# Altium schematic sheet 2CAN_Peripherals.SchDoc
size Tabloid; SheetNumber: 3; SheetTotal: 3
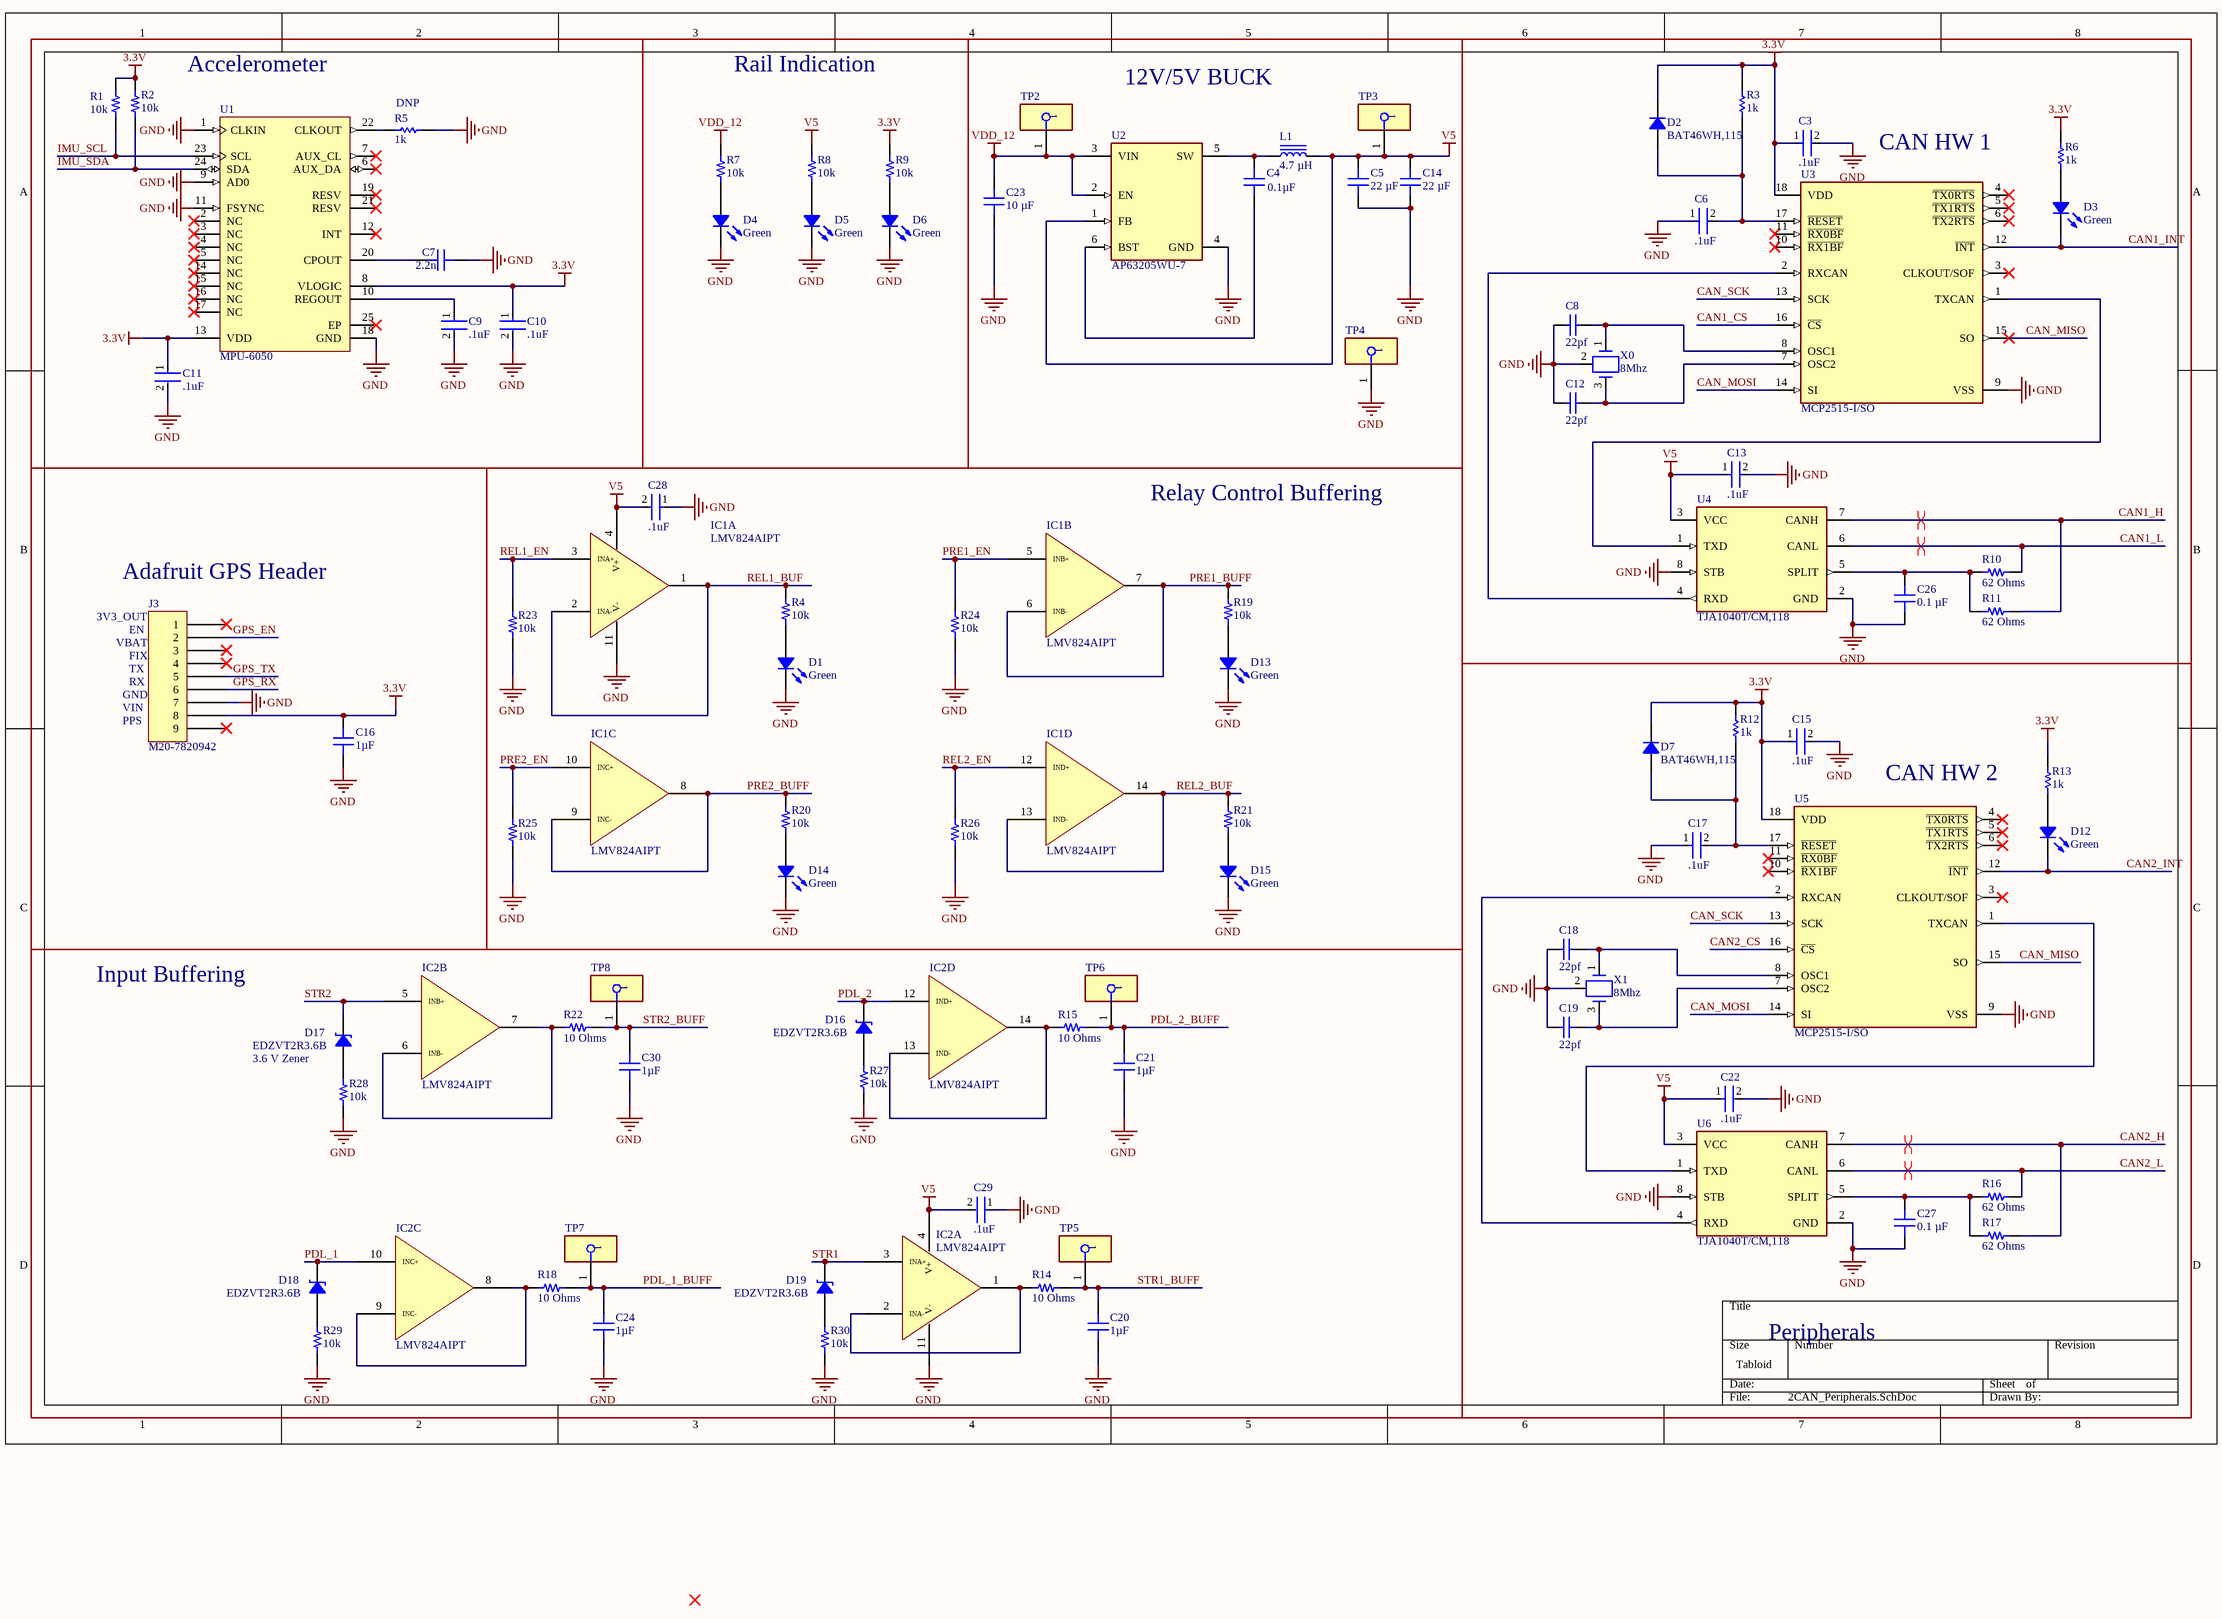
[diagram p0: 2CAN_Peripherals.SchDoc]

## Parts
C3  .1uF  [FP-CGA3E-0_3-0_1-IPC_A]
C4  0.1µF  [CAP 0603_1608]
C5  22 µF  [CAP 0805_2012]
C6  .1uF  [FP-CGA3E-0_3-0_1-IPC_A]
C7  2.2n  [CAP 0603_1608]
C8  22pf  [CAPC1608X90X35ML10T15]
C9  .1uF  [FP-CGA3E-0_3-0_1-IPC_A]
C10  .1uF  [FP-CGA3E-0_3-0_1-IPC_A]
C11  .1uF  [FP-CGA3E-0_3-0_1-IPC_A]
C12  22pf  [CAPC1608X90X35ML10T15]
C13  .1uF  [FP-CGA3E-0_3-0_1-IPC_A]
C14  22 µF  [CAP 0805_2012]
C15  .1uF  [FP-CGA3E-0_3-0_1-IPC_A]
C16  1µF  [CAP 0603_1608]
C17  .1uF  [FP-CGA3E-0_3-0_1-IPC_A]
C18  22pf  [CAPC1608X90X35ML10T15]
C19  22pf  [CAPC1608X90X35ML10T15]
C20  1µF  [CAP 0603_1608]
C21  1µF  [CAP 0603_1608]
C22  .1uF  [FP-CGA3E-0_3-0_1-IPC_A]
C23  10 µF  [CAP 0805_2012]
C24  1µF  [CAP 0603_1608]
C26  0.1 µF  [CAP 0603_1608]
C27  0.1 µF  [CAP 0603_1608]
C28  .1uF  [FP-CGA3E-0_3-0_1-IPC_A]
C29  .1uF  [FP-CGA3E-0_3-0_1-IPC_A]
C30  1µF  [CAP 0603_1608]
D1  Green  [LED 0603_1608 GREEN]
D2  BAT46WH,115  [SOD123F]
D3  Green  [LED 0603_1608 GREEN]
D4  Green  [LED 0603_1608 GREEN]
D5  Green  [LED 0603_1608 GREEN]
D6  Green  [LED 0603_1608 GREEN]
D7  BAT46WH,115  [SOD123F]
D12  Green  [LED 0603_1608 GREEN]
D13  Green  [LED 0603_1608 GREEN]
D14  Green  [LED 0603_1608 GREEN]
D15  Green  [LED 0603_1608 GREEN]
D16  EDZVT2R3.6B  [SOD523F]
D17  EDZVT2R3.6B  [SOD523F]
D18  EDZVT2R3.6B  [SOD523F]
D19  EDZVT2R3.6B  [SOD523F]
IC1  LMV824AIPT  [TI TSSOP-14 PW]  (parts A,B,C,D of 4)
IC2  LMV824AIPT  [TI TSSOP-14 PW]  (parts A,B,C,D of 4)
J3  M20-7820942  [HARWIN M20-7820945]
L1  4.7 µH  [WURTH WE-LQS 6045]
R1  10k  [RES 0603_1608]
R2  10k  [RES 0603_1608]
R3  1k  [RESC1608X55X30LL15T15]
R4  10k  [RES 0603_1608]
R5  1k  [RESC1608X55X30LL15T15]
R6  1k  [RESC1608X55X30LL15T15]
R7  10k  [RES 0603_1608]
R8  10k  [RES 0603_1608]
R9  10k  [RES 0603_1608]
R10  62 Ohms  [RES 0603_1608]
R11  62 Ohms  [RES 0603_1608]
R12  1k  [RESC1608X55X30LL15T15]
R13  1k  [RESC1608X55X30LL15T15]
R14  10 Ohms  [RES 0603_1608]
R15  10 Ohms  [RES 0603_1608]
R16  62 Ohms  [RES 0603_1608]
R17  62 Ohms  [RES 0603_1608]
R18  10 Ohms  [RES 0603_1608]
R19  10k  [RES 0603_1608]
R20  10k  [RES 0603_1608]
R21  10k  [RES 0603_1608]
R22  10 Ohms  [RES 0603_1608]
R23  10k  [RES 0603_1608]
R24  10k  [RES 0603_1608]
R25  10k  [RES 0603_1608]
R26  10k  [RES 0603_1608]
R27  10k  [RES 0603_1608]
R28  10k  [RES 0603_1608]
R29  10k  [RES 0603_1608]
R30  10k  [RES 0603_1608]
TP2  S2761-46R  [FP-S2761-46R-MFG]  (value not drawn)
TP3  S2761-46R  [FP-S2761-46R-MFG]  (value not drawn)
TP4  S2761-46R  [FP-S2761-46R-MFG]  (value not drawn)
TP5  S2761-46R  [FP-S2761-46R-MFG]  (value not drawn)
TP6  S2761-46R  [FP-S2761-46R-MFG]  (value not drawn)
TP7  S2761-46R  [FP-S2761-46R-MFG]  (value not drawn)
TP8  S2761-46R  [FP-S2761-46R-MFG]  (value not drawn)
U1  MPU-6050  [IS-QFN-24_V]
U2  AP63205WU-7  [FP-TSOT26-MFG]
U3  MCP2515-I/SO  [FP-C04-051-IPC_C]
U4  TJA1040T/CM,118  [FP-SOT96-1-MFG]
U5  MCP2515-I/SO  [FP-C04-051-IPC_C]
U6  TJA1040T/CM,118  [FP-SOT96-1-MFG]
X0  8Mhz  [ECS-4X-3IL]
X1  8Mhz  [ECS-4X-3IL]

## Blocks framed on the sheet
Accelerometer: C7 C9-C11 R1 R2 R5 U1
Rail Indication: D4-D6 R7-R9
12V/5V BUCK: C4 C5 C14 C23 L1 TP2-TP4 U2
CAN HW 1: C3 C6 C8 C12 C13 C26 D2 D3 R3 R6 R10 R11 U3 U4 X0
Adafruit GPS Header: C16 J3
Relay Control Buffering: C28 D1 D13-D15 IC1 R4 R19-R21 R23-R26
Input Buffering: C20 C21 C24 C29 C30 D16-D19 IC2 R14 R15 R18 R22 R27-R30 TP5-TP8

## Nets
3.3V: C3.1 C10.1 C11.1 C15.1 C16.2 D2.2 D7.2 J3.8 R1.2 R2.2 R3.1 R6.1 R9.2 R12.1 R13.1 U1.8(VLOGIC) U1.13(VDD) U3.18(VDD) U5.18(VDD)
GND: C3.2 C5.1 C6.1 C7.2 C8.1 C9.2 C10.2 C11.2 C12.1 C13.2 C14.1 C15.2 C16.1 C17.1 C18.1 C19.1 C20.1 C21.1 C22.2 C23.1 C24.1 C26.1 C27.1 C28.1 C29.1 C30.1 D1.2 D4.2 D5.2 D6.2 D13.2 D14.2 D15.2 IC1.11(V-) IC2.11(V-) J3.7 R5.2 R23.1 R24.1 R25.1 R26.1 R27.1 R28.1 R29.1 R30.1 TP4.1 U1.1(CLKIN) U1.9(AD0) U1.11(FSYNC) U1.18(GND) U2.4(GND) U3.9(VSS) U4.2(GND) U4.8(STB) U5.9(VSS) U6.2(GND) U6.8(STB) X0.2 X1.2
V5: C5.2 C13.1 C14.2 C22.1 C28.2 C29.2 IC1.4(V+) IC2.4(V+) L1.2 R8.2 TP3.1 U2.1(FB) U4.3(VCC) U6.3(VCC)
VDD_12: C23.2 R7.2 TP2.1 U2.2(EN) U2.3(VIN)
CAN1_CS: U3.16(~{CS})
CAN1_H: R11.2 U4.7(CANH)
CAN1_INT: D3.2 U3.12(~{INT})
CAN1_L: R10.2 U4.6(CANL)
CAN2_CS: U5.16(~{CS})
CAN2_H: R17.2 U6.7(CANH)
CAN2_INT: D12.2 U5.12(~{INT})
CAN2_L: R16.2 U6.6(CANL)
CAN_MISO: U3.15(SO) U5.15(SO)
CAN_MOSI: U3.14(SI) U5.14(SI)
CAN_SCK: U3.13(SCK) U5.13(SCK)
GPS_EN: J3.2
GPS_RX: J3.6
GPS_TX: J3.5
IMU_SCL: R1.1 U1.23(SCL)
IMU_SDA: R2.1 U1.24(SDA)
PDL_1: D18.2 IC2.10(INC+)
PDL_1_BUFF: C24.2 R18.2 TP7.1
PDL_2: D16.2 IC2.12(IND+)
PDL_2_BUFF: C21.2 R15.2 TP6.1
PRE1_BUFF: IC1.6(INB-) IC1.7(OUTB) R19.2
PRE1_EN: IC1.5(INB+) R24.2
PRE2_BUFF: IC1.8(OUTC) IC1.9(INC-) R20.2
PRE2_EN: IC1.10(INC+) R25.2
REL1_BUF: IC1.1(OUT) IC1.2(INA-) R4.2
REL1_EN: IC1.3(INA+) R23.2
REL2_BUF: IC1.13(IND-) IC1.14(OUTD) R21.2
REL2_EN: IC1.12(IND+) R26.2
STR1: D19.2 IC2.3(INA+)
STR1_BUFF: C20.2 R14.2 TP5.1
STR2: D17.2 IC2.5(INB+)
STR2_BUFF: C30.2 R22.2 TP8.1
NetC4_1: C4.1 U2.6(BST)
NetC4_2: C4.2 L1.1 U2.5(SW)
NetC6_2: C6.2 D2.1 R3.2 U3.17(~{RESET})
NetC7_1: C7.1 U1.20(CPOUT)
NetC8_2: C8.2 U3.8(OSC1) X0.1
NetC9_1: C9.1 U1.10(REGOUT)
NetC12_2: C12.2 U3.7(OSC2) X0.3
NetC17_2: C17.2 D7.1 R12.2 U5.17(~{RESET})
NetC18_2: C18.2 U5.8(OSC1) X1.1
NetC19_2: C19.2 U5.7(OSC2) X1.3
NetC26_2: C26.2 R10.1 R11.1 U4.5(SPLIT)
NetC27_2: C27.2 R16.1 R17.1 U6.5(SPLIT)
NetD1_1: D1.1 R4.1
NetD3_1: D3.1 R6.2
NetD4_1: D4.1 R7.1
NetD5_1: D5.1 R8.1
NetD6_1: D6.1 R9.1
NetD12_1: D12.1 R13.2
NetD13_1: D13.1 R19.1
NetD14_1: D14.1 R20.1
NetD15_1: D15.1 R21.1
NetD16_1: D16.1 R27.2
NetD17_1: D17.1 R28.2
NetD18_1: D18.1 R29.2
NetD19_1: D19.1 R30.2
NetIC2_1: IC2.1(OUT) IC2.2(INA-) R14.1
NetIC2_6: IC2.6(INB-) IC2.7(OUTB) R22.1
NetIC2_8: IC2.8(OUTC) IC2.9(INC-) R18.1
NetIC2_13: IC2.13(IND-) IC2.14(OUTD) R15.1
NetR5_1: R5.1 U1.22(CLKOUT)
NetU3_1: U3.1(TXCAN) U4.1(TXD)
NetU3_2: U3.2(RXCAN) U4.4(RXD)
NetU5_1: U5.1(TXCAN) U6.1(TXD)
NetU5_2: U5.2(RXCAN) U6.4(RXD)

Not connected (* = marked no-connect by the designer): J3 1* 3* 4* 9*; U1 2(NC)* 3(NC)* 4(NC)* 5(NC)* 6(AUX_DA)* 7(AUX_CL)* 12(INT)* 14(NC)* 15(NC)* 16(NC)* 17(NC)* 19(RESV)* 21(RESV)* 25(EP)*; U3 3(CLKOUT/SOF)* 4(~{TX0RTS})* 5(~{TX1RTS})* 6(~{TX2RTS})* 10(~{RX1BF})* 11(~{RX0BF})*; U5 3(CLKOUT/SOF)* 4(~{TX0RTS})* 5(~{TX1RTS})* 6(~{TX2RTS})* 10(~{RX1BF})* 11(~{RX0BF})*

## Layout directives
differential pair: CAN1_H, CAN1_L, CAN2_H, CAN2_L

## Notes on the sheet
- (near R5) DNP
- (near J3) 3V3_OUT
- (near J3) VBAT
- (near J3) EN
- (near J3) FIX
- (near J3) TX
- (near J3) RX
- (near J3) GND
- (near J3) VIN
- (near J3) PPS
- (near U5) CAN HW 2
- 3.6 V Zener
- Peripherals

## Library data of the parts
C3 C6 C9-C11 C13 C15 C17 C22 C28 C29 = CMP-2000-07546-2: Cap Ceramic 100nF 50V X7R 10% Pad SMD 0603 +125°C Automotive T/R; Weight: 7.1E-05oz; Composition: Ceramic; Max Operating Temperature: 125°C; Termination: SMD/SMT; Dielectric: X7R; Length: 1.6mm; Package Quantity: 1; REACH SVHC: No SVHC; Lead Free: Lead Free; Case Code (Metric): 1608; Min Operating Temperature: -55°C; Packaging: Tape and Reel; Tolerance: 10%; Voltage Rating: 50V; Case Code (Imperial): 0603; Capacitance: 100nF; Case/Package: 0603; Voltage Rating (DC): 50V; Depth: 0.8mm; Radiation Hardening: No; Ratings: AEC-Q200; Mount: Surface Mount; Voltage: 50V; Thickness: 0.035inch; Width: 0.8mm; Height: 0.8mm
C4 = 06035C104JAT4A: CAP CER 0.1UF 50V X7R 0603; Part Number: 06035C104JAT4A; Value: 0.1µF
C5 C14 = 08053D226MAT2A: CAP CER 22UF 25V X5R 0805; manufacturer: KYOCERA AVX; Tolerance: ±20%; Part Number: 08053D226MAT2A; Value: 22 µF; Applications: General Purpose; Capacitance: 22 µF; componentlink1description: Datasheet; componentlink1url: https://datasheets.kyocera-avx.com/cx5r.pdf; componentlink2description: DigiKey Link; componentlink2url: https://www.digikey.com/en/products/detail/kyocera-avx/08053D226MAT2A/6229006; Device Package: 0805 (2012 Metric); lastupdated: 2/9/2024 8:14:59 PM; Lifecycle Status: Active; Minimum Order: 1; Mounting Type: Surface Mount, MLCC; Operating Temperature: -55°C ~ 85°C; Package / Case: 0805 (2012 Metric); packaging: TapeAndReel; partid: 44290; Part Status: Active; price: 0.27; series: -; Size / Dimension: 0.079" L x 0.049" W (2.00mm x 1.25mm); Supplier 1: DigiKey; Supplier Part Number 1: 478-08053D226MAT2ACT-ND; Temperature Coefficient: X5R; Thickness (Max): 0.060" (1.52mm); Voltage - Rated: 25V
C7 = C0603C222K4RECAUTO: CAP CER 0603 2.2NF 16V X7R 10%; manufacturer: KEMET; Capacitance: 2200 pF; Part Number: C0603C222K4RECAUTO; Value: 2.2n; Applications: Automotive, ESD Protection; componentlink1description: Datasheet; componentlink1url: https://api.kemet.com/component-edge/download/datasheet/C0603C222K4RECAUTO.pdf; componentlink2description: DigiKey Link; componentlink2url: https://www.digikey.com/en/products/detail/kemet/C0603C222K4RECAUTO/8646528; Device Package: 0603 (1608 Metric); lastupdated: 10/20/2023 7:08:34 PM; Lifecycle Status: Active; Minimum Order: 1; Mounting Type: Surface Mount, MLCC; Operating Temperature: -55°C ~ 125°C; Package / Case: 0603 (1608 Metric); packaging: TapeAndReel; partid: 35311; Part Status: Active; price: 0.01; Ratings: AEC-Q200; series: ESD SMD Auto X7R; Size / Dimension: 0.063" L x 0.031" W (1.60mm x 0.80mm); Supplier 1: DigiKey; Supplier Part Number 1: 399-C0603C222K4RECAUTOCT-ND; Temperature Coefficient: X7R; Thickness (Max): 0.034" (0.87mm); Tolerance: ±10%; Voltage - Rated: 16V
C8 C12 C18 C19 = CMP-2000-04945-1: Chip Capacitor, 22 pF, +/- 5%, 50 V, -55 to 125 degC, 0603 (1608 Metric), RoHS, Tape and Reel; Manufacturer: Murata; Rated Voltage: 50V; Dielectric: C0G; Capacitance: 22pF; Manufacturer URL: http://www.murata.com/; Datasheet Version: Jul-06; Package Reference: 603; Tolerance (%): ±5%; Case Size/Dimension: 0603; Package Description: 2-Pin Surface Mount Device, Body 1.6 x 0.8 mm; Datasheet URL: https://datasheet.ciiva.com/11786/0900766b807a1cab-11786398.pdf
C16 C20 C21 C24 C30 = 06033D105MAT2A: CAP CER 1UF 25V X5R 0603; manufacturer: AVX Corporation; Tolerance: ±20%; Part Number: 06033D105MAT2A; Value: 1µF; Applications: General Purpose; Capacitance: 1µF; componentlink1description: Datasheet; componentlink1url: http://datasheets.avx.com/cx5r.pdf; componentlink2description: DigiKey Link; componentlink2url: http://digikey.com/product-detail/en/avx-corporation/06033D105MAT2A/478-4531-1-ND/1645882; Device Package: 0603 (1608 Metric); lastupdated: 9/2/2020 1:03:35 AM; Lifecycle Status: Active; Minimum Order: 1; Mounting Type: Surface Mount, MLCC; Operating Temperature: -55°C ~ 85°C; Package / Case: 0603 (1608 Metric); packaging: TapeAndReel; partid: 2656; Part Status: Active; price: 0.11; series: -; Size / Dimension: 0.063" L x 0.032" W (1.60mm x 0.81mm); Supplier 1: DigiKey; Supplier Part Number 1: 478-4531-1-ND; Temperature Coefficient: X5R; Thickness (Max): 0.035" (0.90mm); Voltage - Rated: 25V
C23 = GRM21BR61H106KE43L: CAP CER 10UF 50V X5R 0805; manufacturer: Murata Electronics; Tolerance: ±10%; Part Number: GRM21BR61H106KE43L; Value: 10 µF; Applications: General Purpose; Capacitance: 10 µF; componentlink1description: Datasheet; componentlink1url: https://search.murata.co.jp/Ceramy/image/img/A01X/G101/ENG/GRM21BR61H106KE43-01A.pdf; componentlink2description: DigiKey Link; componentlink2url: https://www.digikey.com/en/products/detail/murata-electronics/GRM21BR61H106KE43L/10326316; Device Package: 0805 (2012 Metric); lastupdated: 2/9/2024 8:15:53 PM; Lifecycle Status: Active; Minimum Order: 1; Mounting Type: Surface Mount, MLCC; Operating Temperature: -55°C ~ 85°C; Package / Case: 0805 (2012 Metric); packaging: TapeAndReel; partid: 39284; Part Status: Active; price: 0.05; series: GRM; Size / Dimension: 0.079" L x 0.049" W (2.00mm x 1.25mm); Supplier 1: DigiKey; Supplier Part Number 1: 490-18663-1-ND; Temperature Coefficient: X5R; Thickness (Max): 0.057" (1.45mm); Voltage - Rated: 50V
C26 C27 = HMK107B7104KA-T: CAP CER 0.1UF 100V X7R 0603; manufacturer: Taiyo Yuden; Tolerance: ±10%; Part Number: HMK107B7104KA-T; Value: 0.1 µF; Applications: SMPS Filtering; Capacitance: 0.1 µF; componentlink1description: Datasheet; componentlink1url: https://ds.yuden.co.jp/TYCOMPAS/ut/detail?pn=HMK107B7104KA-T &u=M; componentlink2description: DigiKey Link; componentlink2url: https://www.digikey.com/en/products/detail/taiyo-yuden/HMK107B7104KA-T/5810931; Device Package: 0603 (1608 Metric); Features: High Voltage; lastupdated: 2/9/2024 8:10:29 PM; Lifecycle Status: Active; Minimum Order: 1; Mounting Type: Surface Mount, MLCC; Operating Temperature: -55°C ~ 125°C; Package / Case: 0603 (1608 Metric); packaging: TapeAndReel; partid: 2899; Part Status: Active; price: 0.01; series: M; Size / Dimension: 0.063" L x 0.031" W (1.60mm x 0.80mm); Supplier 1: DigiKey; Supplier Part Number 1: 587-6322-1-ND; Temperature Coefficient: X7R; Thickness (Max): 0.035" (0.90mm); Voltage - Rated: 100V
D1 D3-D6 D12-D15 = SML-LX0603GW-TR: LED GREEN DIFFUSED SMD; Manufacturer: Lumex Opto/Components Inc.; Configuration: Standard; Current - Test: 20mA; Lens Color: White; Lens Size: 1.00mm x 0.80mm; Lens Style: Rectangle with Flat Top; Millicandela Rating: 18mcd; Viewing Angle: 160°; Voltage - Forward (Vf) (Typ): 2.2V; Wavelength - Peak: 565nm; Part Number: SML-LX0603GW-TR; Color: Green; ComponentLink1Description: Datasheet; ComponentLink1URL: https://www.lumex.com/content/files/ProductAttachment/SML-LX0603GW-TR.pdf; ComponentLink2Description: DigiKey Link; ComponentLink2URL: https://www.digikey.com/en/products/detail/lumex-opto-components-inc/SML-LX0603GW-TR/304359; Device Package: 0603 (1608 Metric); Height (Max): 0.60mm; LastUpdated: 2/8/2024 9:31:29 PM; Lens Transparency: Diffused; Lifecycle Status: Active; Minimum Order: 1; Mounting Type: Surface Mount; Package / Case: 0603 (1608 Metric); Packaging: TapeAndReel; PartId: 665; Part Status: Active; Price: 0.05; Series: -; Size / Dimension: 1.60mm L x 0.80mm W; Supplier 1: DigiKey; Supplier Part Number 1: 67-1549-1-ND; Value: Green
D2 D7 = BAT46WH,115: DIODE SCHOTT 100V 250MA SOD123F; Manufacturer: Nexperia USA Inc.; Capacitance @ Vr, F: 39pF @ 0V, 1MHz; Current - Reverse Leakage @ Vr: 9 µA @ 100 V; Diode Type: Schottky; Reverse Recovery Time (trr): 5.9 ns; Speed: Fast Recovery =< 500ns, > 200mA (Io); Voltage - Forward (Vf) (Max) @ If: 850 mV @ 250 mA; Part Number: BAT46WH,115; ComponentLink1Description: Datasheet; ComponentLink1URL: https://assets.nexperia.com/documents/data-sheet/BAT46WH.pdf; ComponentLink2Description: DigiKey Link; ComponentLink2URL: https://www.digikey.com/en/products/detail/nexperia-usa-inc/BAT46WH-115/2405997; Current - Average Rectified (Io): 250mA; LastUpdated: 9/1/2023 8:23:16 PM; Lifecycle Status: Active; Minimum Order: 1; Mounting Type: Surface Mount; Operating Temperature - Junction: 150°C (Max); Package / Case: SOD-123F; Packaging: TapeAndReel; PartId: 2399; Part Status: Active; Price: 0.04; Series: Automotive, AEC-Q100; Supplier 1: DigiKey; Supplier Part Number 1: 1727-4816-1-ND; Supplier Device Package: SOD-123F; Voltage - DC Reverse (Vr) (Max): 100 V
D16-D19 = EDZVT2R3.6B: DIODE ZENER 3.6V 150MW EMD2; Manufacturer: Rohm Semiconductor; Current - Reverse Leakage @ Vr: 10 µA @ 1 V; Impedance (Max) (Zzt): 100 Ohms; Tolerance: ±3%; Part Number: EDZVT2R3.6B; ComponentLink1Description: Datasheet; ComponentLink1URL: https://www.rohm.com/datasheet/EDZV3.6B/edzvt2r3.6b-e; ComponentLink2Description: DigiKey Link; ComponentLink2URL: https://www.digikey.com/en/products/detail/rohm-semiconductor/EDZVT2R3-6B/4004366; LastUpdated: 2/8/2024 9:28:59 PM; Lifecycle Status: Active; Minimum Order: 1; Mounting Type: Surface Mount; Operating Temperature: -55°C ~ 150°C; Package / Case: SC-79, SOD-523; Packaging: TapeAndReel; PartId: 3388; Part Status: Active; Power - Max: 150 mW; Price: 0.03; Series: EDZV; Supplier 1: DigiKey; Supplier Part Number 1: EDZVT2R3.6BCT-ND; Supplier Device Package: EMD2; Voltage - Zener (Nom) (Vz): 3.6 V
IC1 IC2 = LMV824AIPT: IC OPAMP GP 4 CIRCUIT 14TSSOP; Manufacturer: STMicroelectronics; Amplifier Type: General Purpose; Current - Input Bias: 60nA; Current - Output / Channel: 70mA; Current - Supply: 300µA; Gain Bandwidth Product: 5.5MHz; Number of Circuits: 4; Output Type: Rail-to-Rail; Slew Rate: 1.9V/µs; Voltage - Input Offset: 800µV; Voltage - Supply, Single/Dual (±): 2.5V ~ 5.5V; Part Number: LMV824AIPT; ComponentLink1Description: Datasheet; ComponentLink1URL: http://www.st.com/content/ccc/resource/technical/document/datasheet/39/12/97/14/01/a7/4f/de/DM00041851.pdf/files/DM00041851.pdf/jcr:content/translations/en.DM00041851.pdf; ComponentLink2Description: DigiKey Link; ComponentLink2URL: http://digikey.com/product-detail/en/stmicroelectronics/LMV824AIPT/497-12825-1-ND/3028576; Device Package: 14-TSSOP (0.173", 4.40mm Width); LastUpdated: 1/9/2020 2:13:49 AM; Lifecycle Status: Active; Minimum Order: 1; Mounting Type: Surface Mount; Operating Temperature: -40°C ~ 125°C; Package / Case: 14-TSSOP (0.173", 4.40mm Width); Packaging: ReReel; PartId: 21; Part Status: Active; Price: 0.00; Series: -; Supplier 1: DigiKey; Supplier Part Number 1: 497-12825-1-ND; Supplier Device Package: 14-TSSOP
J3 = M20-7820942: CONN RCPT 9POS 0.1 GOLD PCB; Manufacturer: Harwin Inc.; Connector Type: Receptacle; Current Rating (Amps): 3A; Mated Stacking Heights: 11.04mm, 12.63mm; Material Flammability Rating: UL94 V-0; Number of Positions: 9; Number of Positions Loaded: All; Style: Board to Board or Cable; Part Number: M20-7820942; ComponentLink1Description: Datasheet; ComponentLink1URL: https://cdn.harwin.com/pdfs/C001XX_M20_Series_Connectors.pdf; ComponentLink2Description: DigiKey Link; ComponentLink2URL: http://digikey.com/product-detail/en/harwin-inc/M20-7820942/M20-7820942-ND/3919444; Contact Finish - Mating: Gold; Contact Finish - Post: Tin; Contact Finish Thickness - Mating: Flash; Contact Type: Female Socket; Fastening Type: Push-Pull; Insulation Color: Black; LastUpdated: 9/21/2022 6:58:48 PM; Lifecycle Status: Active; Minimum Order: 5016; Mounting Type: Through Hole; Number of Rows: 1; Operating Temperature: -40°C ~ 105°C; Packaging: Tube; Part Status: Active; Price: 0.59; Series: M20; Supplier 1: DigiKey; Supplier Part Number 1: M20-7820942-ND; Termination: Solder
L1 = 74404064047: FIXED IND 4.7UH 3.3A 26 MOHM SMD; Manufacturer: Würth Elektronik; Current - Saturation: 5.5A; DC Resistance (DCR): 26mOhm; Frequency - Self Resonant: 36MHz; Inductance Frequency - Test: 100 kHz; Material - Core: Ferrite; Shielding: Semi-Shielded; Tolerance: ±30%; Type: Drum Core, Wirewound; Part Number: 74404064047; ComponentLink1Description: Datasheet; ComponentLink1URL: https://katalog.we-online.de/pbs/datasheet/74404064047.pdf; ComponentLink2Description: DigiKey Link; ComponentLink2URL: https://www.digikey.com/en/products/detail/würth-elektronik/74404064047/4865691; Current Rating (Amps): 3.3 A; Device Package: Nonstandard; Height - Seated (Max): 0.177" (4.50mm); Inductance: 4.7 µH; LastUpdated: 2/8/2024 9:54:36 PM; Lifecycle Status: Active; Minimum Order: 1; Mounting Type: Surface Mount; Operating Temperature: -40°C ~ 125°C; Package / Case: Nonstandard; Packaging: TapeAndReel; PartId: 3709; Part Status: Active; Price: 0.74; Ratings: AEC-Q200; Series: WE-LQS; Size / Dimension: 0.236" L x 0.236" W (6.00mm x 6.00mm); Supplier 1: DigiKey; Supplier Part Number 1: 732-5546-1-ND; Supplier Device Package: 6045; Value: 4.7 µH
R1 R2 R4 R7-R9 R19-R21 R23-R30 = CPF0603B10KE: RES SMD 10K OHM 0.1% 1/16W 0603; Manufacturer: TE Connectivity Passive Product; Power (Watts): 0.063W, 1/16W; Resistance: 10 kOhms; Temperature Coefficient: ±25ppm/°C; Part Number: CPF0603B10KE; Value: 10k; ComponentLink1Description: Datasheet; ComponentLink1URL: https://www.te.com/commerce/DocumentDelivery/DDEController?Action=srchrtrv&DocNm=1773200&DocType=DS&DocLang=English; ComponentLink2Description: DigiKey Link; ComponentLink2URL: https://www.digikey.com/en/products/detail/te-connectivity-passive-product/CPF0603B10KE/2389826; Composition: Thin Film; Device Package: 0603 (1608 Metric); Height - Seated (Max): 0.022" (0.55mm); LastUpdated: 10/20/2023 7:33:49 PM; Lifecycle Status: Active; Minimum Order: 1; Number of Terminations: 2; Operating Temperature: -55°C ~ 155°C; Package / Case: 0603 (1608 Metric); Packaging: TapeAndReel; PartId: 4872; Part Status: Active; Price: 0.09; Series: CPF, Neohm; Size / Dimension: 0.061" L x 0.031" W (1.55mm x 0.80mm); Supplier 1: DigiKey; Supplier Part Number 1: A119886CT-ND; Supplier Device Package: 0603; Tolerance: ±0.1%
R3 R5 R6 R12 R13 = CMP-2000-00180-1: Part Number: ERJ-3EKF1001V; Manufacturer: Panasonic
R10 R11 R16 R17 = SDR03EZPJ620: HIGH ANTI-SURGE THICK FILM CHIP; Manufacturer: Rohm Semiconductor; Power (Watts): 0.3W; Temperature Coefficient: ±200ppm/°C; Tolerance: ±5%; Part Number: SDR03EZPJ620; Value: 62 Ohms; ComponentLink1Description: Datasheet; ComponentLink1URL: https://fscdn.rohm.com/en/products/databook/datasheet/passive/resistor/chip_resistor/sdr-e.pdf; ComponentLink2Description: DigiKey Link; ComponentLink2URL: https://www.digikey.com/en/products/detail/rohm-semiconductor/SDR03EZPJ620/16180101; Composition: Thick Film; Device Package: 0603 (1608 Metric); Features: Automotive AEC-Q200, Pulse Withstanding; Height - Seated (Max): 0.022" (0.55mm); LastUpdated: 2/9/2024 8:41:06 PM; Lifecycle Status: Active; Minimum Order: 1; Number of Terminations: 2; Operating Temperature: -55°C ~ 155°C; Package / Case: 0603 (1608 Metric); Packaging: TapeAndReel; PartId: 68802; Part Status: Active; Price: 0.01; Ratings: AEC-Q200; Resistance: 62 Ohms; Series: SDR; Size / Dimension: 0.063" L x 0.031" W (1.60mm x 0.80mm); Supplier 1: DigiKey; Supplier Part Number 1: 511-SDR03EZPJ620CT-ND; Supplier Device Package: 0603
R14 R15 R18 R22 = CR0603AFX-10R0EAS: RESA-AS 0603 10R 1% 100MW TC100; Manufacturer: Bourns Inc.; Power (Watts): 0.1W, 1/10W; Temperature Coefficient: ±100ppm/°C; Part Number: CR0603AFX-10R0EAS; Value: 10 Ohms; ComponentLink1Description: Datasheet; ComponentLink1URL: //media.digikey.com/pdf/Data%20Sheets/Bourns%20PDFs/CRyyyyA-AS_Model_DS.pdf; ComponentLink2Description: DigiKey Link; ComponentLink2URL: https://www.digikey.com/en/products/detail/bourns-inc/CR0603AFX-10R0EAS/10240119; Composition: Thick Film; Device Package: 0603 (1608 Metric); Features: Anti-Sulfur, Automotive AEC-Q200, Moisture Resistant; Height - Seated (Max): 0.022" (0.55mm); LastUpdated: 9/1/2023 7:37:06 PM; Lifecycle Status: Active; Minimum Order: 1; Number of Terminations: 2; Operating Temperature: -55°C ~ 155°C; Package / Case: 0603 (1608 Metric); Packaging: TapeAndReel; PartId: 23787; Part Status: Active; Price: 0.01; Ratings: AEC-Q200; Resistance: 10 Ohms; Series: CR0603A-AS; Size / Dimension: 0.063" L x 0.031" W (1.60mm x 0.80mm); Supplier 1: DigiKey; Supplier Part Number 1: CR0603AFX-10R0EASCT-ND; Supplier Device Package: 0603; Tolerance: ±1%
TP2-TP8 = CMP-15817-000011-1: PC TEST POINT NATURAL; Body Material: Brass; Plating: Tin; Material: Copper Alloy; Mount: Surface Mount; Color: Natural; Packaging: Tape and Reel; RoHS Compliant: Yes
U1 = CMP-1753-00002-2: 3-Axis Gyroscope, Accelerometer and a Digital Motion Processor(TM) (DMP), 2.375 to 3.46 V, -40 to 85 degC, 24-Pin QFN, RoHS, Tape and Reel; Manufacturer: InvenSense; Featured Product: MPU-60506-Axis,IntegratedI²CSolution; Other Names: 1428-1007-2 / MPU6050; Sensor Type: MotionTracking; Online Catalog: MPU-6000™Series; Unit PriceUSD: Digital; Datasheet Version: Rev. 3.3, 05/2012; Category: Sensors,Transducers; Datasheet URL: http://datasheet.octopart.com/MPU-6050-InvenSense-datasheet-14421344.pdf; Family: Multifunction; Standard Package: 5,000; Manufacturer URL: http://www.invensense.com/; Output Type: Digital; Dynamic Catalog: MPU-6000™Series
U2 = CMP-12757-000001-1: IC REG BUCK 5V 2A TSOT26; Manufacturer: Diodes Inc.; Max Junction Temp: +160°C; Max Duty Cycle: 100%; Standoff Height: 0.01mm; Max Supply Voltage: 32V; Number Of Outputs: 1; Min Supply Voltage: 3.8V; Output Type: Fixed; Switching Frequency: 1100kHz; Nominal Supply Current: 22uA; Automotive: No; RoHS: TRUE; Switching Topology: Buck; Temperature: -40°C to +85°C; Footprint Url: https://www.diodes.com/assets/Package-Files/TSOT26.pdf; Lead Free: Yes; Digikey Description: IC REG BUCK 5V 2A TSOT26; Device Class L3: Voltage Regulators - Switching; Ambient Temperature Range High: +85°C; Category: IC; Package: TSOT26; Output Voltage: 5V; Output Current: 2A; ComponentLink2Description: Datasheet; Device Class L2: Power Management ICs; Ambient Temperature Range Low: -40°C; Temperature Range High: +85°C; Temperature Range Low: -40°C; Octopart: https://octopart.com/ap63205wu-7-diodes+inc.-98099551; Manufacturer Part Number: AP63205WU-7; Height: 1mm; Device Class L1: Integrated Circuits (ICs); ComponentLink2URL: https://www.diodes.com/assets/Datasheets/AP63200-AP63201-AP63203-AP63205.pdf
U3 U5 = CMP-0186-00133-3: IC CAN CONTROLLER W/SPI 18SOIC; Manufacturer: Microchip; Min Supply Voltage: 2.7V; Max Supply Voltage: 5.5V; Standoff Height: 0.1mm; Nominal Supply Current: 10mA; Interface: SPI,CAN; Lead Free: Yes; Digikey Description: IC CAN CONTROLLER W/SPI 18SOIC; Category: IC; RoHS: TRUE; Manufacturer Part Number: MCP2515-I/SO; ComponentLink2URL: http://ww1.microchip.com/downloads/en/DeviceDoc/MCP2515-Stand-Alone-CAN-Controller-with-SPI-20001801J.pdf; Mouser Description: CAN Interface IC W/ SPI Interface; Device Class L2: Interface ICs; Package: C04-051; Automotive: No; Function: Controller; Octopart: https://octopart.com/mcp2515-i%2Fso-microchip-430187; Temperature: -40°C to +85°C; Ipc Land Pattern Name: SOIC127P1030X265-18; Ambient Temperature Range Low: -65°C; Height: 2.65mm; Device Class L1: Integrated Circuits (ICs); Ambient Temperature Range High: +125°C; Footprint Url: http://ww1.microchip.com/downloads/en/DeviceDoc/18L_SOIC_Wide_7.50_SO_C04-0051D.pdf; Temperature Range Low: -40°C; Device Class L3: Controllers; Temperature Range High: +85°C; ComponentLink2Description: Datasheet
U4 U6 = CMP-2000-07244-2: IC TRANSCEIVER HALF 1/1 8SO; Max Supply Voltage: 5.25V; Max Supply Current: 70mA; Simplex/Duplex: Half Duplex; Number of Transmit Buffers: 1; Operating Supply Voltage: 5V; Min Supply Voltage: 4.75V; Data Rate: 1Mbps; Interface: Serial; Receiver Hysteresis: 70mV; Number of Pins: 8; REACH SVHC: No SVHC; Nominal Supply Current: 70mA; Contact Plating: Gold; Mount: Surface Mount; Radiation Hardening: No; Lead Free: Lead Free; Packaging: Tape and Reel; Package Quantity: 1; Number of Transceivers: 1; Case/Package: SO; Min Operating Temperature: -40°C; Max Operating Temperature: 150°C; Number of Receive Buffers: 1
X0 X1 = CMP-1669-00002-2: CRYSTAL 8.00 MHZ 20PF 49US; PartNumber: ECS-80-20-4X; Manufacturer: ECS; ComponentLink1URL: http://www.ecsxtal.com/store/pdf/hc-49usx.pdf; ComponentLink1Description: Datasheet; PackageReference: 4X-3IL